# EAGLE design Mega Stepper Shield (EAGLE 9.6.2)
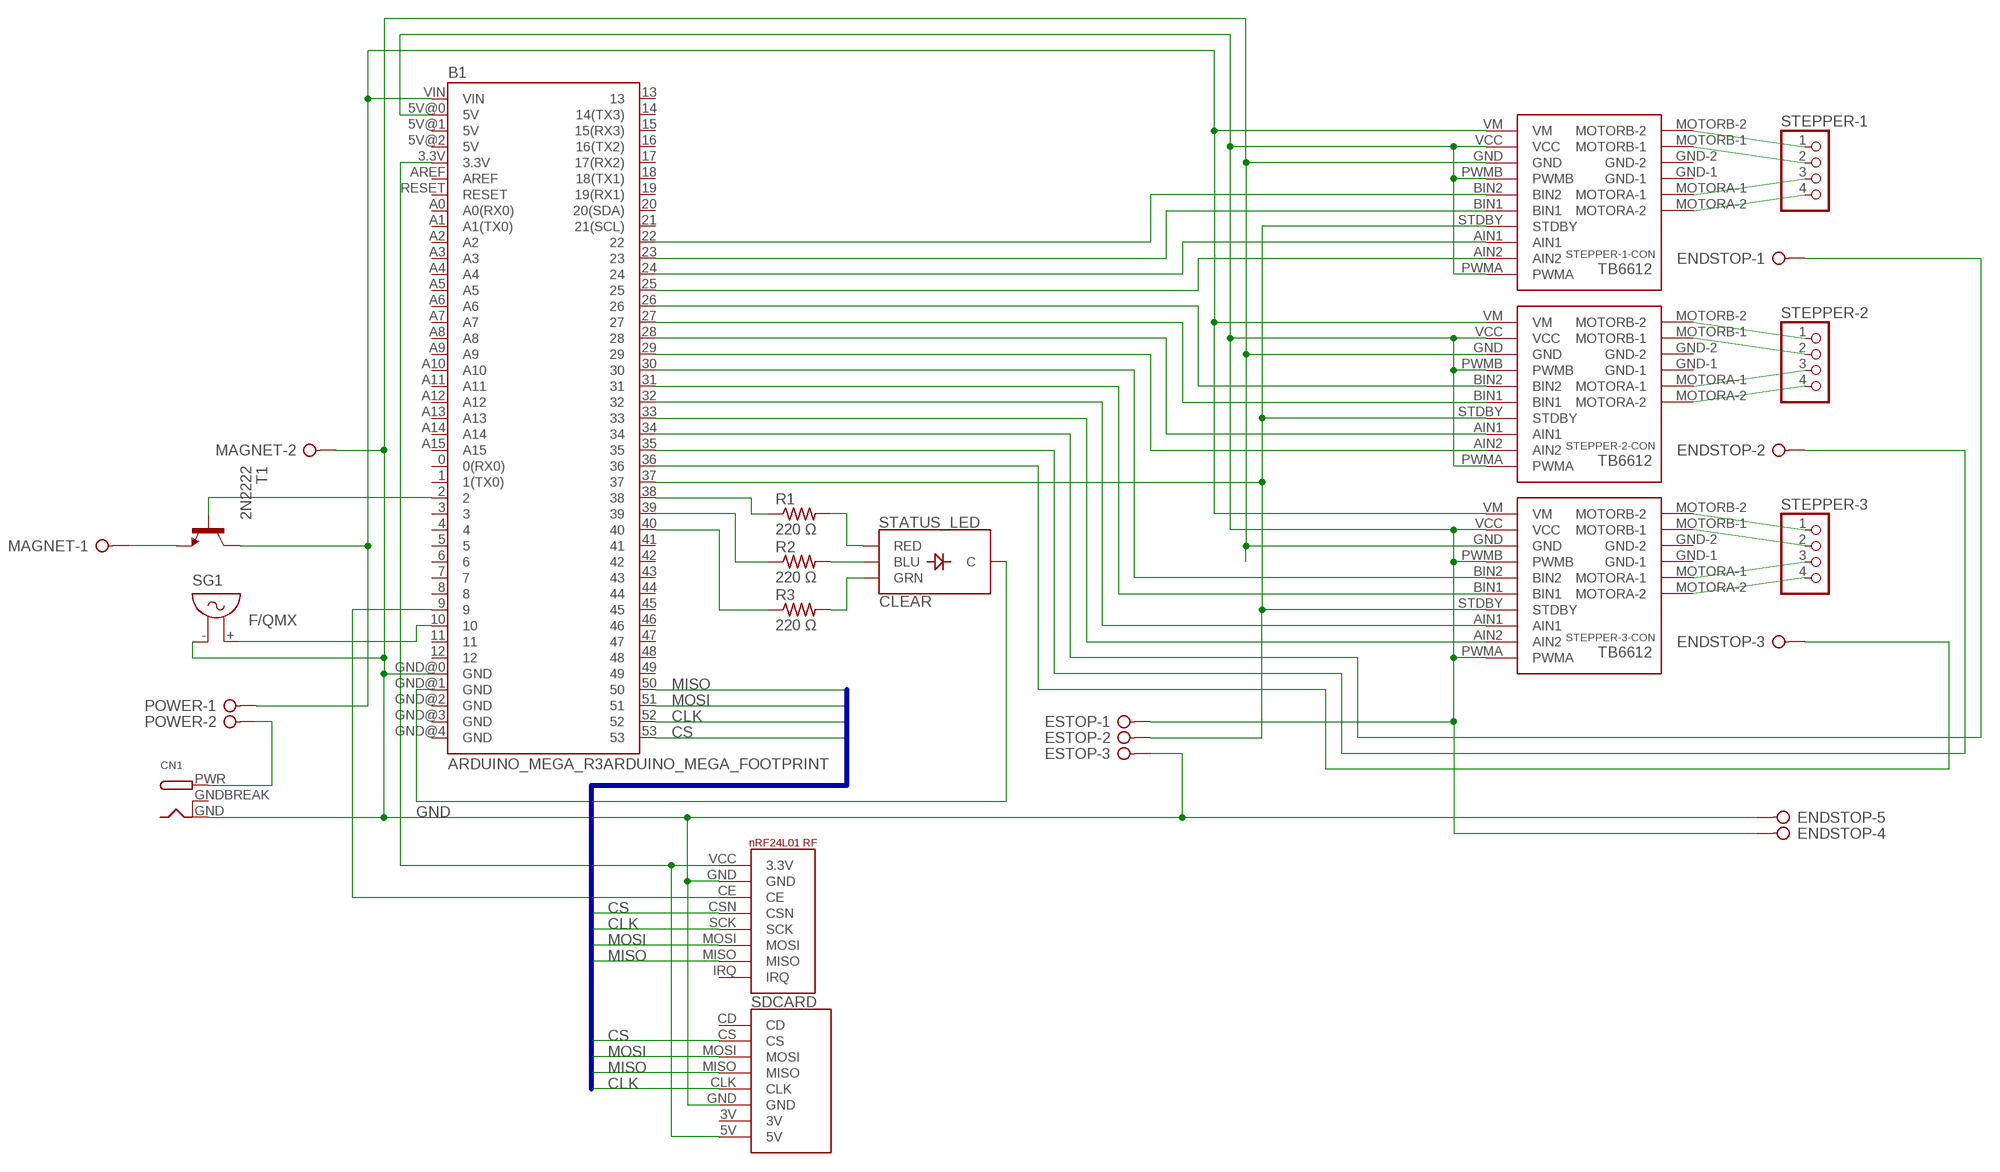
[diagram p0: schematic, sheet 1]

## Parts
B1  ARDUINO_MEGA_R3ARDUINO_MEGA_FOOTPRINT  [ARDUINO_MEGA_SHIELD_DIMENSIONLESS]
CN1  DCBARRELPTH  [DCJACK_2MM_PTH]
ENDSTOP  W237-05P  [W237-5P]
ESTOP  W237-3E  [W237-3E]
MAGNET  W237-02P  [W237-132]
POWER  W237-02P  [W237-132]
R1  220 Ω  R-US_0204/7  [0204/7]
R2  220 Ω  R-US_0204/7  [0204/7]
R3  220 Ω  R-US_0204/7  [0204/7]
SDCARD  MICRO_SD_BREAKOUT  [MICROSDCARDBREAKOUT]
SG1  F/QMX  [F/QMX]
STATUS_LED  CLEAR  LED-RGB-CCCLEAR  [LED-RGB-THRU]
STEPPER-1  PINHD-1X4  [1X04]
STEPPER-1-CON  TB6612-BREAKOUT-MOTOR-CONTROLLER  [TB6612-HEADERS]
STEPPER-2  PINHD-1X4  [1X04]
STEPPER-2-CON  TB6612-BREAKOUT-MOTOR-CONTROLLER  [TB6612-HEADERS]
STEPPER-3  PINHD-1X4  [1X04]
STEPPER-3-CON  TB6612-BREAKOUT-MOTOR-CONTROLLER  [TB6612-HEADERS]
T1  2N2222  [TO92-EBC-OVAL]
U$1  NRF24L01_RF_MODULE  [NRF24L01RF]

## Nets
3.3V [Power]: B1.3.3V SDCARD.5V U$1.VCC(3.3V)
5V: B1.5V@0(5V) ENDSTOP.4 ESTOP.1 STEPPER-1-CON.PWMA STEPPER-1-CON.PWMB STEPPER-1-CON.VCC STEPPER-2-CON.PWMA STEPPER-2-CON.PWMB STEPPER-2-CON.VCC STEPPER-3-CON.PWMA STEPPER-3-CON.PWMB STEPPER-3-CON.VCC
12V10A [Power]: B1.VIN POWER.1 STEPPER-1-CON.VM STEPPER-2-CON.VM STEPPER-3-CON.VM T1.C
AIN1: B1.24 STEPPER-1-CON.AIN1
AIN2: B1.25 STEPPER-1-CON.AIN2
BIN2: B1.22 STEPPER-1-CON.BIN2
CLK: B1.52 SDCARD.CLK U$1.SCK
CS: B1.53 SDCARD.CS U$1.CSN
GND [Power]: B1.GND@0(GND) CN1.GND ENDSTOP.5 ESTOP.3 MAGNET.2 SDCARD.GND SG1.- STEPPER-1-CON.GND STEPPER-2-CON.GND STEPPER-3-CON.GND U$1.GND
MISO: B1.50 SDCARD.MISO U$1.MISO
MOSI: B1.51 SDCARD.MOSI U$1.MOSI
N$1: B1.36 ENDSTOP.3
N$2: B1.10 SG1.+
N$3: B1.30 STEPPER-3-CON.BIN2
N$4: B1.26 STEPPER-2-CON.BIN2
N$5: B1.27 STEPPER-2-CON.BIN1
N$6: B1.28 STEPPER-2-CON.AIN1
N$7: B1.29 STEPPER-2-CON.AIN2
N$8: B1.31 STEPPER-3-CON.BIN1
N$9: B1.32 STEPPER-3-CON.AIN1
N$10: B1.33 STEPPER-3-CON.AIN2
N$11 [Power]: CN1.PWR POWER.2
N$12: B1.35 ENDSTOP.2
N$13: B1.37 ESTOP.2 STEPPER-1-CON.STDBY STEPPER-2-CON.STDBY STEPPER-3-CON.STDBY
N$14: B1.34 ENDSTOP.1
N$15 [Stepper Output]: STEPPER-1-CON.MOTORB-2 STEPPER-1.1
N$16 [Stepper Output]: STEPPER-1-CON.MOTORB-1 STEPPER-1.2
N$17 [Stepper Output]: STEPPER-1-CON.MOTORA-1 STEPPER-1.3
N$18 [Stepper Output]: STEPPER-1-CON.MOTORA-2 STEPPER-1.4
N$19 [Stepper Output]: STEPPER-2-CON.MOTORB-2 STEPPER-2.1
N$20 [Stepper Output]: STEPPER-2-CON.MOTORB-1 STEPPER-2.2
N$21 [Stepper Output]: STEPPER-2-CON.MOTORA-1 STEPPER-2.3
N$22 [Stepper Output]: STEPPER-2-CON.MOTORA-2 STEPPER-2.4
N$23 [Stepper Output]: STEPPER-3-CON.MOTORB-2 STEPPER-3.1
N$24 [Stepper Output]: STEPPER-3-CON.MOTORB-1 STEPPER-3.2
N$25 [Stepper Output]: STEPPER-3-CON.MOTORA-1 STEPPER-3.3
N$26 [Stepper Output]: STEPPER-3-CON.MOTORA-2 STEPPER-3.4
N$27: B1.23 STEPPER-1-CON.BIN1
N$28: R3.2 STATUS_LED.3(GRN)
N$29: R2.2 STATUS_LED.4(BLU)
N$30: R1.2 STATUS_LED.1(RED)
N$31: B1.GND@1(GND) STATUS_LED.2(C)
N$34: B1.9 U$1.CE
N$38: B1.38 R1.1
N$39: B1.39 R2.1
N$40: B1.40 R3.1
N$41: B1.2 T1.B
N$42 [Power]: MAGNET.1 T1.E
Unconnected: B1.0(0(RX0)) B1.1(1(TX0)) B1.3 B1.4 B1.5 B1.5V@1(5V) B1.5V@2(5V) B1.6 B1.7 B1.8 B1.11 B1.12 B1.13 B1.14(14(TX3)) B1.15(15(RX3)) B1.16(16(TX2)) B1.17(17(RX2)) B1.18(18(TX1)) B1.19(19(RX1)) B1.20(20(SDA)) B1.21(21(SCL)) B1.41 B1.42 B1.43 B1.44 B1.45 B1.46 B1.47 B1.48 B1.49 B1.A0(A0(RX0)) B1.A1(A1(TX0)) B1.A2 B1.A3 B1.A4 B1.A5 B1.A6 B1.A7 B1.A8 B1.A9 B1.A10 B1.A11 B1.A12 B1.A13 B1.A14 B1.A15 B1.AREF B1.GND@2(GND) B1.GND@3(GND) B1.GND@4(GND) B1.RESET SDCARD.3V SDCARD.CD STEPPER-1-CON.GND-1 STEPPER-1-CON.GND-2 STEPPER-2-CON.GND-1 STEPPER-2-CON.GND-2 STEPPER-3-CON.GND-1 STEPPER-3-CON.GND-2 U$1.IRQ

## Buses
SPI:CLK,CS,MISO,MOSI

## Power pins joined to a net without a drawn wire
GNDBREAK: CN1.GNDBREAK

## Library data of the parts
B1 = SparkFun-Boards-Expanded:ARDUINO_MEGA_R3: Arduino Mega R3 ATmega2560 R3 compatible footprint. SparkFun Products: Arduino Mega 2560 R3 <https://www.sparkfun.com/products/11061>
CN1 = adafruit:DCBARREL: 2.0mm DC Barrel Jack DCJACK_2MM_PTH - Through Hole Jack (4UConnector: 05537)
ENDSTOP = con-wago-508:W237-05P: WAGO SREW CLAMP; OC_FARNELL: unknown; OC_NEWARK: unknown
ESTOP = con-wago-508:W237-3E: WAGO SREW CLAMP; OC_FARNELL: unknown; OC_NEWARK: unknown
MAGNET POWER = con-wago-508:W237-02P: WAGO SREW CLAMP; OC_FARNELL: unknown; OC_NEWARK: unknown
R1-R3 = adafruit:R-US_: RESISTOR, American symbol
SDCARD = SparkFun-Boards-Expanded:MICRO_SD_BREAKOUT: Micro SD Card breakout board, product ID 254 https://www.adafruit.com/product/254
SG1 = buzzer:F/QMX: BUZZER Source: Buerklin; OC_FARNELL: unknown; OC_NEWARK: unknown
STATUS_LED = SparkFun-LED:LED-RGB-CC: LED-RGB Common Cathode Packages: LED RGB-THRU LED_PIRANHA_5MM SparkFun Products: RGB Diffused Common Cathode- Diffuse <[https://www.sparkfun.com/products/9264]> RGB Diffused Common Cathode - Clear <[https://www.sparkfun.com/products/105]> LED-RGB 5mm Square (Piranha) <[https://www.sparkfun.com/products/11679]>; PROD_ID: DIO-08418
STEPPER-1-STEPPER-3 = pinhead:PINHD-1X4: PIN HEADER
STEPPER-1-CON STEPPER-2-CON STEPPER-3-CON = SparkFun-Boards-Expanded:TB6612-BREAKOUT-MOTOR-CONTROLLER: TB6612 breakout headers
T1 = adafruit:2N2222: NPN TRANSISTOR Big oval pads
U$1 = SparkFun-Boards-Expanded:NRF24L01_RF_MODULE: Basic RF module

## Net classes
0 Signal: width 0.178 mm
1 Power: width 1.27 mm
2 Stepper Output: width 0.508 mm

## Board
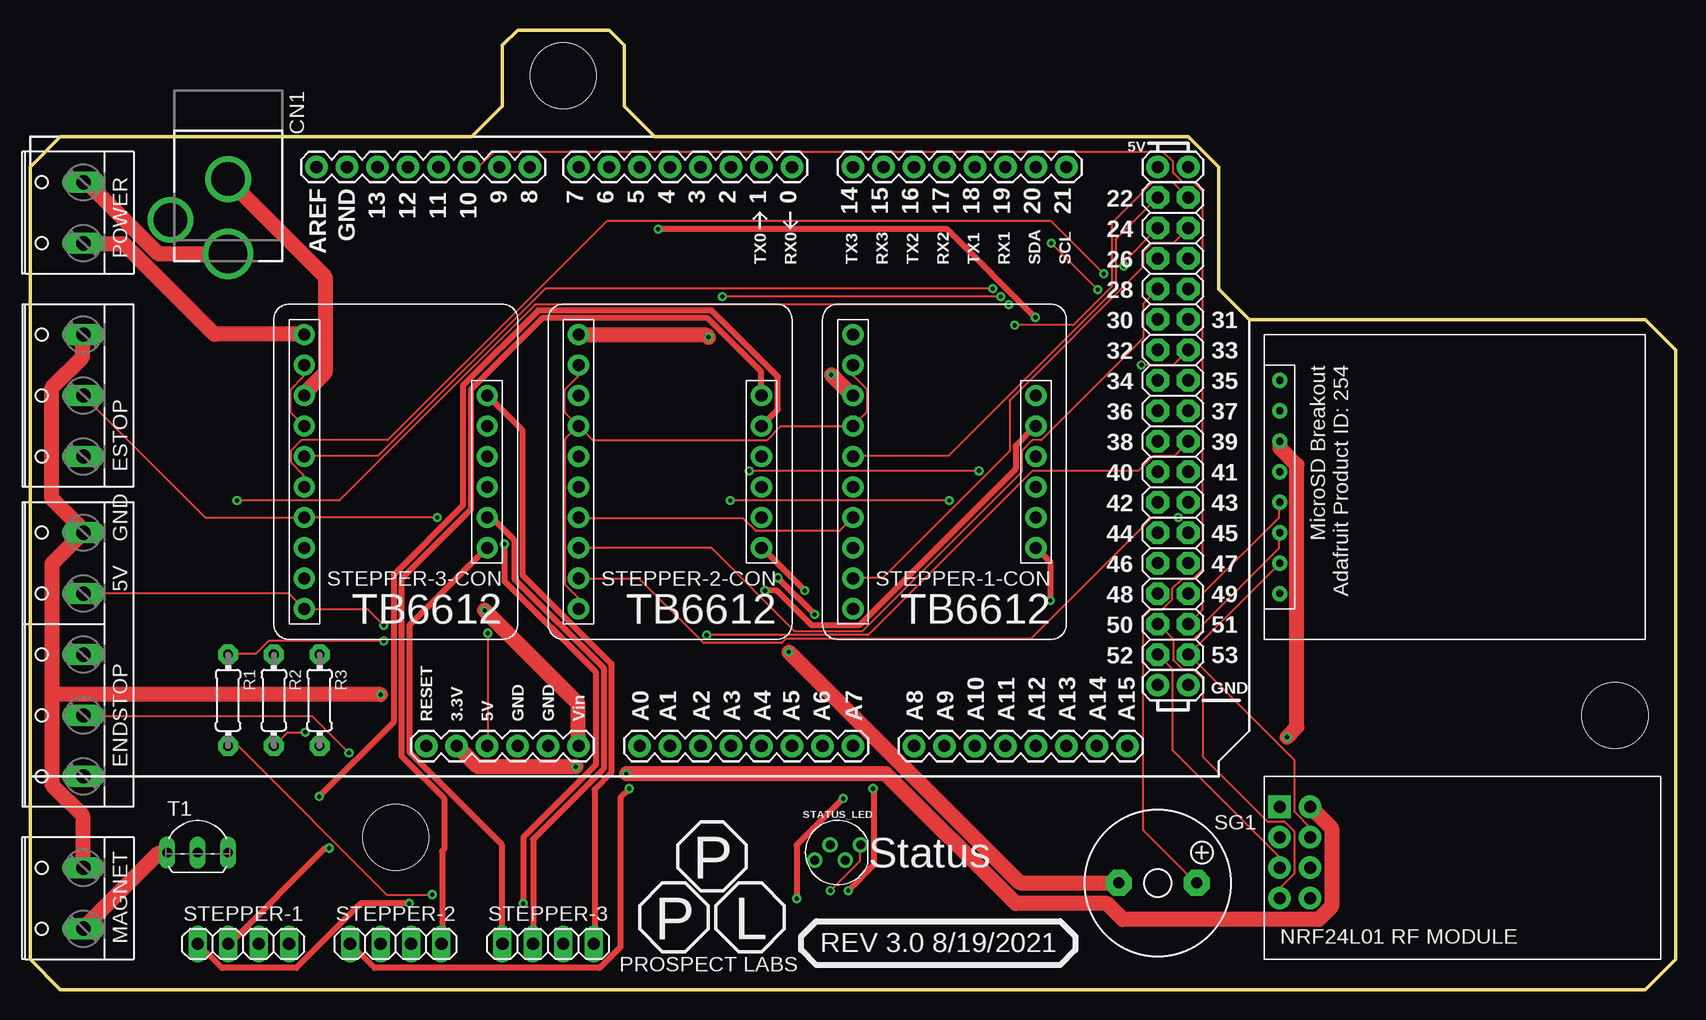
[diagram p1: board, top side]
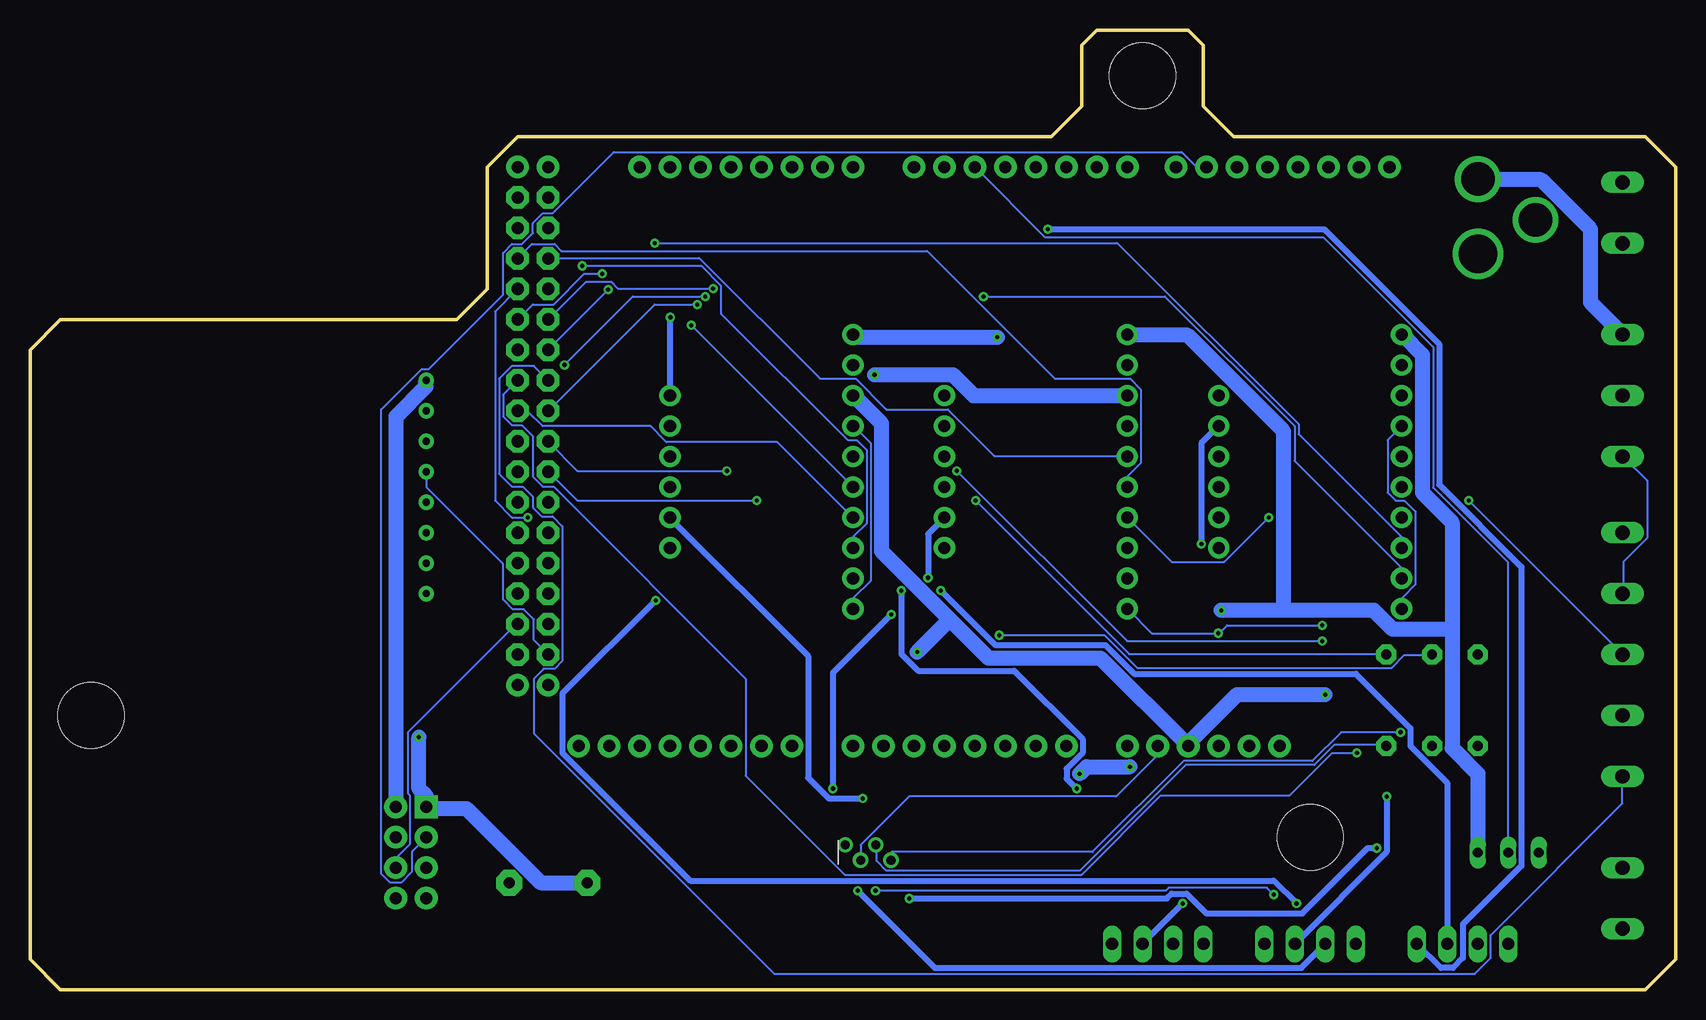
[diagram p2: board, bottom side, seen from below]

Size 137.16 x 80.01 mm. Coordinates in mm from the lower left corner, seen from the top.
Outline: 0,2.54 0,68.58 2.54,71.12 36.83,71.12 39.37,73.66 39.37,78.74 40.64,80.01 48.26,80.01 49.53,78.74 49.53,73.66 52.07,71.12 96.52,71.12 99.06,68.58 99.06,58.42 101.6,55.88 134.62,55.88 137.16,53.34 137.16,2.54 134.62,0 2.54,0 0,2.54
Copper layers (1*16): Top 0.035mm / dielectric 1.5mm / Bottom 0.035mm
Design rules "default": minimum track width 6mil, minimum drill 0.35mm, track to track 6mil, track to pad 6mil, pad to pad 6mil, via to via 6mil, smd to smd 6mil, copper to edge 40mil, drill to drill 6mil, minimum pad ring 10mil, minimum via ring 8mil, stop-mask expansion 4mil, vias tented up to drill 0mil, thermal gap 10mil
Holes 5.5 mm at 30.48,12.7 132.08,22.86 44.45,76.2
tRestrict: area 49.5,1.3 to 63.5,15.2; area 64.3,1.4 to 87.1,6.5
vRestrict: area 26.4,8.6 to 34.5,16.8; area 128,18.8 to 136.1,26.9; area 40.4,72.1 to 48.5,80.3

### Footprints (pad centres in the part's own frame; a part is rotated, then mirrored left to right if it is on the bottom)
ARDUINO_MEGA_SHIELD_DIMENSIONLESS = drill 1.016 pad 1.88: 0 13.97,24.13; 1 11.43,24.13; 2 8.89,24.13; 3 6.35,24.13; 3.3V -13.97,-24.13; 4 3.81,24.13; 5 1.27,24.13; 5V@0 -11.43,-24.13; 5V@1 44.45,24.13; 5V@2 46.99,24.13; 6 -1.27,24.13; 7 -3.81,24.13; 8 -7.874,24.13; 9 -10.414,24.13; 10 -12.954,24.13; 11 -15.494,24.13; 12 -18.034,24.13; 13 -20.574,24.13; 14 19.05,24.13; 15 21.59,24.13; 16 24.13,24.13; 17 26.67,24.13; 18 29.21,24.13; 19 31.75,24.13; 20 34.29,24.13; 21 36.83,24.13; A0 1.27,-24.13; A1 3.81,-24.13; A2 6.35,-24.13; A3 8.89,-24.13; A4 11.43,-24.13; A5 13.97,-24.13; A6 16.51,-24.13; A7 19.05,-24.13; A8 24.13,-24.13; A9 26.67,-24.13; A10 29.21,-24.13; A11 31.75,-24.13; A12 34.29,-24.13; A13 36.83,-24.13; A14 39.37,-24.13; A15 41.91,-24.13; AREF -25.654,24.13; GND@0 -8.89,-24.13; GND@1 -6.35,-24.13; GND@2 44.45,-19.05; GND@3 46.99,-19.05; GND@4 -23.114,24.13; RESET -16.51,-24.13; VIN -3.81,-24.13 | drill 1.016 pad 1.88 octagon: 22 44.45,21.59; 23 46.99,21.59; 24 44.45,19.05; 25 46.99,19.05; 26 44.45,16.51; 27 46.99,16.51; 28 44.45,13.97; 29 46.99,13.97; 30 44.45,11.43; 31 46.99,11.43; 32 44.45,8.89; 33 46.99,8.89; 34 44.45,6.35; 35 46.99,6.35; 36 44.45,3.81; 37 46.99,3.81; 38 44.45,1.27; 39 46.99,1.27; 40 44.45,-1.27; 41 46.99,-1.27; 42 44.45,-3.81; 43 46.99,-3.81; 44 44.45,-6.35; 45 46.99,-6.35; 46 44.45,-8.89; 47 46.99,-8.89; 48 44.45,-11.43; 49 46.99,-11.43; 50 44.45,-13.97; 51 46.99,-13.97; 52 44.45,-16.51; 53 46.99,-16.51
DCJACK_2MM_PTH = drill 2.8: GND 0,7.35; GNDBREAK 4.8,10.75 | drill 3.2: PWR 0,13.6
W237-5P = drill 1.194 long: 1 -10.16,-0.635; 2 -5.08,-0.635; 3 0,-0.635; 4 5.08,-0.635; 5 10.16,-0.635
W237-3E = drill 1.194 long: 1 -5.08,-0.635; 2 0,-0.635; 3 5.08,-0.635
W237-132 = drill 1.194 long: 1 -2.54,-0.635; 2 2.54,-0.635
0204/7 = drill 0.813 pad 1.676 octagon: 1 -3.81,0; 2 3.81,0
MICROSDCARDBREAKOUT = drill 0.6 pad 1.27: 3V 5.08,-6.35; 5V 5.08,-8.89; CD 5.08,8.89; CLK 5.08,-1.27; CS 5.08,6.35; GND 5.08,-3.81; MISO 5.08,3.81; MOSI 5.08,1.27
F/QMX = drill 0.914 pad 2.159 octagon: + 3.251,0; - -3.251,0
LED-RGB-THRU = drill 0.762 pad 1.016: 1 1.905,0.635; 2 0.635,-0.635; 3 -0.635,0.635; 4 -1.905,-0.635
1X04 = drill 1.016 long: 1 -3.81,0; 2 -1.27,0; 3 1.27,0; 4 3.81,0
TB6612-HEADERS = drill 1.016 pad 1.778: AIN1 -7.62,-6.35; AIN2 -7.62,-8.89; BIN1 -7.62,-1.27; BIN2 -7.62,1.27; GND -7.62,6.35; GND-1 7.62,-1.27; GND-2 7.62,1.27; MOTORA-1 7.62,-3.81; MOTORA-2 7.62,-6.35; MOTORB-1 7.62,3.81; MOTORB-2 7.62,6.35; PWMA -7.62,-11.43; PWMB -7.62,3.81; STDBY -7.62,-3.81; VCC -7.62,8.89; VM -7.62,11.43
TO92-EBC-OVAL = drill 0.813 long: B 0,-1.27; C 2.54,-1.27; E -2.54,-1.27
NRF24L01RF = drill 1.016 pad 1.88: CE 0,8.89; CSN 2.54,8.89; IRQ 2.54,3.81; MISO 0,3.81; MOSI 2.54,6.35; SCK 0,6.35; VCC 2.54,11.43 | drill 1.016 pad 1.88 square: GND 0,11.43

### Placement (x,y rotation side)
B1  49.53,44.45 0 top
CN1  16.51,74.93 180 top
ENDSTOP  3.81,27.94 90 top
ESTOP  3.81,49.53 90 top
MAGNET  3.81,7.62 90 top
POWER  3.81,64.77 90 top
R1  16.51,24.13 270 top
R2  20.32,24.13 270 top
R3  24.13,24.13 270 top
SDCARD  109.22,41.91 180 top
SG1  93.98,8.89 0 top
STATUS_LED  67.31,11.43 0 top
STEPPER-1  17.78,3.81 180 top
STEPPER-1-CON  76.2,43.18 0 top
STEPPER-2  30.48,3.81 180 top
STEPPER-2-CON  53.34,43.18 0 top
STEPPER-3  43.18,3.81 180 top
STEPPER-3-CON  30.48,43.18 0 top
T1  13.97,12.7 0 top
U$1  104.14,3.81 0 top

### Tracks (layer width: path | path; a pad name or v marks a point on that pad's centre or on a via)
3.3V  (via drill 0.35)
  Top 1.27: v45.48,18.57 37.31,18.57 35.58,20.31 B1.3.3V | v49.7,18 71.32,18 82.14,7.18 89.73,7.18 91.05,5.86 107.4,5.86 108.47,6.93 108.47,13.46 106.74,15.19 U$1.VCC
  Bottom 1.27: SDCARD.5V 104.18,50.77 104.18,50.27 106.66,47.8 106.66,15.27 U$1.VCC | v45.48,18.57 49.12,18.57 v49.7,18
5V  (via drill 0.35)
  Top 0.178: STEPPER-3-CON.VCC 22.78,52.01 22.78,51.1 21.71,50.02 21.71,48.13 22.78,47.05 STEPPER-3-CON.PWMB | ENDSTOP.4 21.55,33.02 22.78,31.78 STEPPER-3-CON.PWMA 22.87,31.7 28.15,31.7 v29.47,30.38 | STEPPER-1-CON.VCC 68.6,52.01 68.6,51.18 69.75,50.02 69.75,48.21 68.6,47.05 STEPPER-1-CON.PWMB 68.52,46.97 62.57,46.97 61.42,45.81 46.89,45.81 45.73,46.97 STEPPER-2-CON.PWMB | STEPPER-2-CON.PWMA 45.65,31.78 45.65,32.69 44.58,33.76 44.58,45.9 45.65,46.97 STEPPER-2-CON.PWMB | STEPPER-2-CON.VCC 45.65,52.01 45.65,51.1 44.58,50.02 44.58,48.13 45.65,47.05 STEPPER-2-CON.PWMB | v38.14,29.72 38.14,20.39 B1.5V@0
  Bottom 0.178: ENDSTOP.4 4.38,33.02 4.38,35.66 2.39,37.64 2.39,42.43 4.38,44.41 ESTOP.1 | STEPPER-3-CON.PWMA 22.78,31.78 22.78,32.69 21.71,33.76 21.71,39.87 22.62,40.78 23.36,40.78 24.02,41.44 24.02,45.81 22.87,46.97 STEPPER-3-CON.PWMB | STEPPER-1-CON.PWMA 68.52,31.78 68.52,32.69 67.11,34.09 67.11,45.57 68.52,46.97 STEPPER-1-CON.PWMB | STEPPER-2-CON.PWMA 45.65,31.7 43.67,29.72 v38.14,29.72 38.06,29.72 37.4,30.38 v29.47,30.38
12V10A  (via drill 0.35)
  Top 1.27: v56.55,54.4 56.38,54.57 45.73,54.57 STEPPER-2-CON.VM | POWER.1 4.46,62.16 7.84,62.16 15.35,54.65 22.78,54.65 STEPPER-3-CON.VM | v37.89,31.62 45.65,23.86 45.65,20.39 B1.VIN
  Bottom 1.27: v56.55,54.4 68.35,54.4 68.52,54.57 STEPPER-1-CON.VM | T1.C 16.51,18 18.66,20.14 18.66,30.05 | 18.66,30.05 18.66,38.96 21.13,41.44 21.13,52.91 22.78,54.57 STEPPER-3-CON.VM | 32.69,31.62 25.18,31.62 23.61,30.05 18.66,30.05 | 32.69,31.62 v37.89,31.62 | 32.69,31.62 32.69,46.56 40.7,54.57 45.65,54.57 STEPPER-2-CON.VM
AIN1  (via drill 0.35)
  Top 0.178: v91.14,60.34 91.14,60.67 93.94,63.48 B1.24
  Bottom 0.178: v91.14,60.34 81.23,60.34 79.58,58.69 79.58,56.38 69.01,45.81 68.27,45.81 67.44,44.99 67.44,38.88 68.52,37.81 68.52,36.9 STEPPER-1-CON.AIN1
AIN2
  Top 0.178: B1.25 95.26,62.24 93.53,62.24 92.79,61.5 92.79,60.26 81.64,49.12 81.64,44.91 71.08,34.34 68.6,34.34 STEPPER-1-CON.AIN2
BIN2
  Top 0.178: STEPPER-1-CON.BIN2 68.6,44.49 76.52,44.49 90.47,58.45 90.47,62.57 93.94,66.04 B1.22
CLK
  Top 0.178: U$1.SCK 104.1,10.24 104.1,11.06 95.18,19.98 95.18,26.75 94.02,27.9 B1.52
  Bottom 0.178: B1.52 95.18,29.14 95.18,30.87 96.01,31.7 96.91,31.7 97.74,32.52 97.74,35.5 104.1,41.85 104.1,43.17 SDCARD.CLK
CS
  Top 0.178: SDCARD.CS 104.1,35.5 96.58,27.98 B1.53 96.58,27.9 105.33,19.15 105.33,14.86 106.66,13.54 106.66,12.71 U$1.CSN
GND  (via drill 0.35)
  Top 1.27: STEPPER-3-CON.GND 22.87,49.7 24.6,51.43 24.6,59.44 16.51,67.53 CN1.GND | 1.82,24.6 1.82,35.5 4.38,38.06 ENDSTOP.5 4.13,38.63 1.82,40.95 1.82,50.19 4.38,52.75 4.38,54.57 ESTOP.3 | 1.82,24.6 1.82,17.09 4.38,14.53 4.38,10.24 MAGNET.2 | v104.76,21.05 105.58,21.88 105.58,43.75 104.18,45.16 104.18,45.65 SDCARD.GND | v66.78,51.26 68.52,49.53 STEPPER-1-CON.GND | v63.23,28.15 82.47,8.91 90.72,8.91 SG1.- | v29.22,24.6 1.82,24.6
  Bottom 1.27: CN1.GND 16.51,67.53 11.23,67.53 7.1,63.4 7.1,57.29 4.46,54.65 ESTOP.3 | v104.76,21.05 104.76,16.76 104.18,16.18 104.18,15.27 U$1.GND 103.52,15.11 100.79,15.11 94.6,8.91 90.81,8.91 SG1.- | STEPPER-2-CON.GND 58.53,49.53 60.26,51.26 v66.78,51.26 | 60.51,30.87 66.2,36.57 66.2,47.22 68.52,49.53 STEPPER-1-CON.GND | 60.51,30.87 57.29,27.65 47.96,27.65 40.7,20.39 B1.GND@0 40.28,20.89 36.57,24.6 v29.22,24.6 | 60.51,30.87 v63.23,28.15
MISO
  Top 0.178: 95.26,29.22 97,29.22 97.74,29.97 97.74,30.46 104.1,36.82 104.1,38.06 SDCARD.MISO | 95.26,29.22 94.02,30.46 B1.50 | 95.26,29.22 95.26,27.49 96.01,26.75 96.91,26.75 97.74,25.92 97.74,19.4 103.11,14.03 104.51,14.03 105.33,13.21 105.33,9.66 104.18,8.5 104.18,7.68 U$1.MISO
MOSI
  Top 0.178: B1.51 97.74,31.7 97.74,33.02 104.1,39.38 104.1,40.62 SDCARD.MOSI
  Bottom 0.178: U$1.MOSI 106.66,10.24 106.66,10.98 105.5,12.13 105.5,16.18 105.66,16.34 105.66,21.46 96.58,30.54 B1.51
N$1  (via drill 0.35)
  Top 0.178: v17.25,40.78 25.76,40.78 42.1,57.12 v81.56,57.12
  Bottom 0.178: v17.25,40.78 4.46,27.98 ENDSTOP.3 | v81.56,57.12 85.11,57.12 93.94,48.29 B1.36
N$2
  Top 0.178: B1.10 36.65,68.6 37.4,68.6 38.63,69.84 94.44,69.84 95.26,69.01 95.26,68.1 96.09,67.28 97,67.28 97.74,66.53 97.74,35.08 96.91,34.26 96.01,34.26 95.18,33.43 95.18,32.52 94.36,31.7 93.45,31.7 92.79,31.04 92.79,13.29 97.16,8.91 SG1.+
N$3  (via drill 0.35)
  Top 0.178: v80.24,58.45 42.93,58.45 28.98,44.49 22.87,44.49 STEPPER-3-CON.BIN2
  Bottom 0.178: v80.24,58.45 88.16,58.45 88.74,59.02 90.81,59.02 93.94,55.89 B1.30
N$4
  Bottom 0.178: STEPPER-2-CON.BIN2 45.73,44.49 56.79,44.49 60.67,48.37 65.79,48.37 68.35,50.93 71.32,50.93 81.39,61 93.94,61 B1.26
N$5
  Bottom 0.178: STEPPER-2-CON.BIN1 45.65,41.94 45.65,42.84 44.58,43.92 44.58,50.02 45.48,50.93 51.76,50.93 62.41,61.58 92.87,61.58 93.45,62.16 95.34,62.16 96.5,61 B1.27
N$6
  Top 0.178: STEPPER-2-CON.AIN1 45.73,36.82 56.79,36.82 63.73,29.88 69.34,29.88 82.63,43.17 82.63,44.91 83.54,45.81 84.28,45.81 92.79,54.32 92.79,57.21 93.94,58.36 B1.28
N$7  (via drill 0.35)
  Top 0.178: v95.67,39.38 93.53,39.38 83.38,29.22 62.99,29.22 62.66,28.89 56.13,28.89 50.77,34.26 45.73,34.26 STEPPER-2-CON.AIN2
  Bottom 0.178: v95.67,39.38 97,39.38 98.4,40.78 98.4,56.55 96.58,58.36 B1.29
N$8  (via drill 0.35)
  Top 0.178: v89.48,59.68 85.11,64.06 48.04,64.06 29.8,45.81 22.62,45.81 21.71,44.91 21.71,44 22.78,42.93 22.78,41.94 STEPPER-3-CON.BIN1
  Bottom 0.178: v89.48,59.68 90.97,59.68 93.53,57.12 95.26,57.12 96.5,55.89 B1.31
N$9  (via drill 0.35)
  Top 0.178: v88.99,58.36 v85.11,62.24
  Bottom 0.178: v85.11,62.24 46.56,62.24 31.45,47.14 31.45,46.31 22.87,37.73 22.87,36.9 STEPPER-3-CON.AIN1 | v88.99,58.36 93.94,53.41 B1.32
N$10  (via drill 0.35)
  Top 0.178: v80.9,57.78 v57.7,57.78 | v92.62,52.09 95.26,52.09 96.5,53.33 B1.33
  Bottom 0.178: v57.7,57.78 42.6,57.78 31.78,46.97 31.78,44.08 22.87,35.17 22.87,34.34 STEPPER-3-CON.AIN2 | v80.9,57.78 86.92,57.78 v92.62,52.09
N$11
  Top 1.27: POWER.2 4.46,67.28 4.79,67.28 10.73,61.34 CN1.PWR
N$12  (via drill 0.35)
  Top 0.178: v26.58,19.73 23.53,22.78 4.46,22.78 ENDSTOP.2
  Bottom 0.178: v26.58,19.73 28.64,19.73 32.19,16.18 42.93,16.18 49.53,9.58 69.26,9.58 77.51,17.83 77.51,25.92 93.53,41.94 94.44,41.94 95.26,42.76 95.26,46.15 96.17,47.05 97,47.05 97.74,47.8 97.74,49.61 96.58,50.77 B1.35
N$13  (via drill 0.35)
  Top 0.178: ESTOP.2 14.61,39.38 22.78,39.38 STEPPER-3-CON.STDBY 22.95,39.38 v33.93,39.38 | STEPPER-2-CON.STDBY 45.73,39.29 59.44,39.29 60.51,38.22 67.44,38.22 68.52,39.29 STEPPER-1-CON.STDBY
  Bottom 0.178: B1.37 96.5,48.21 95.67,48.21 94.44,46.97 85.44,46.97 84.12,45.65 74.87,45.65 68.6,39.38 STEPPER-1-CON.STDBY | v33.93,39.38 37.64,35.66 42.02,35.66 45.65,39.29 STEPPER-2-CON.STDBY
N$14
  Bottom 0.178: ENDSTOP.1 4.46,17.75 4.46,15.52 15.44,4.54 15.44,2.64 16.76,1.32 75.12,1.32 95.18,21.38 95.18,25.92 94.36,26.75 93.45,26.75 92.79,27.41 92.79,38.63 93.61,39.46 94.52,39.46 95.26,40.2 95.26,41.11 96.09,41.94 97,41.94 98.07,43.01 98.07,50.93 97,52.01 95.18,52.01 94.02,50.85 B1.34
N$15  (via drill 0.35)
  Top 0.508: v52.34,63.4 76.44,63.4 v83.79,56.05
  Bottom 0.508: v52.34,63.4 29.3,63.4 19.73,53.82 19.73,42.1 12.88,35.25 12.88,10.32 17.75,5.45 17.75,2.64 18.57,1.82 19.56,1.82 21.55,3.8 STEPPER-1.1 | v83.79,56.05 83.79,49.53 STEPPER-1-CON.MOTORB-2
N$16  (via drill 0.35)
  Top 0.508: v61.25,33.27 62.24,33.27 65.13,30.38 69.09,30.38 82.14,43.42 82.14,45.32 83.79,46.97 STEPPER-1-CON.MOTORB-1
  Bottom 0.508: v61.25,33.27 56.71,28.73 47.55,28.73 45.16,26.33 26.66,26.33 22.12,21.79 22.12,20.31 19.07,17.25 19.07,3.88 STEPPER-1.2
N$17  (via drill 0.35)
  Top 0.508: v24.93,11.8 24.6,11.8 16.68,3.88 16.51,3.88 STEPPER-1.3 | v63.89,7.59 63.89,12.05 v67.77,15.93
  Bottom 0.508: v24.93,11.8 25.67,11.8 31.12,6.36 39.13,6.36 40.78,8.01 42.02,8.01 42.43,7.59 v63.89,7.59 | v67.77,15.93 70.58,15.93 72.31,17.67 72.31,27.82 83.79,39.29 STEPPER-1-CON.MOTORA-1
N$18  (via drill 0.35)
  Top 0.508: v31.62,7.18 27.57,7.18 22.21,1.82 16.02,1.82 14.03,3.8 STEPPER-1.4 | v85.03,32.44 85.03,35.66 83.87,36.82 STEPPER-1-CON.MOTORA-2
  Bottom 0.508: v31.62,7.18 33.52,9.08 82.14,9.08 92.79,19.73 92.79,24.68 v85.03,32.44
N$19
  Top 0.508: STEPPER-2.1 34.34,3.88 34.34,11.56 34.51,11.72 34.51,15.93 30.96,19.48 30.96,34.26 36.73,40.04 36.73,50.02 42.68,55.97 56.46,55.97 60.92,51.51 60.92,49.53 STEPPER-2-CON.MOTORB-2
N$20  (via drill 0.35)
  Top 0.508: v24.11,16.1 30.3,22.29 30.3,34.59 36.07,40.37 36.07,50.35 42.35,56.63 56.79,56.63 62.33,51.1 62.33,48.37 61,47.05 STEPPER-2-CON.MOTORB-1
  Bottom 0.508: v24.11,16.1 24.11,11.47 31.7,3.88 STEPPER-2.2
N$21  (via drill 0.35)
  Top 0.508: v68.19,8.26 70.33,10.4 70.33,16.68 v70.25,16.76 | v62.33,34.34 v65.38,31.29
  Bottom 0.508: STEPPER-2.3 31.2,1.82 61.75,1.82 v68.19,8.26 | v70.25,16.76 70.25,26.42 v65.38,31.29 | v62.33,34.34 62.33,37.97 61,39.29 STEPPER-2-CON.MOTORA-1
N$22  (via drill 0.35)
  Top 0.508: v49.94,16.76 49.2,16.02 49.2,3.55 47.47,1.82 28.73,1.82 26.75,3.8 STEPPER-2.4 | v64.55,33.27 61,36.82 STEPPER-2-CON.MOTORA-2
  Bottom 0.508: v49.94,16.76 50.77,17.58 50.77,18.41 49.45,19.73 49.45,20.89 55.14,26.58 63.15,26.58 64.55,27.98 v64.55,33.27
N$23
  Top 0.508: STEPPER-3.1 47.05,3.88 47.05,16.68 48.46,18.08 48.46,27.16 41.03,34.59 41.03,46.64 38.14,49.53 STEPPER-3-CON.MOTORB-2
N$24  (via drill 0.35)
  Top 0.508: v41.11,7.18 41.11,12.71 47.14,18.74 47.14,26.5 39.54,34.09 v39.54,37.15
  Bottom 0.508: v41.11,7.18 44.41,3.88 STEPPER-3.2 | v39.54,37.15 39.54,45.57 38.14,46.97 STEPPER-3-CON.MOTORB-1
N$25
  Top 0.508: STEPPER-3.3 41.94,3.88 41.94,12.55 47.8,18.41 47.8,26.83 40.37,34.26 40.37,37.48 38.55,39.29 38.14,39.29 STEPPER-3-CON.MOTORA-1
N$26
  Top 0.508: STEPPER-3.4 39.29,3.88 39.29,12.13 31.62,19.81 31.62,30.38 38.06,36.82 STEPPER-3-CON.MOTORA-2
N$27  (via drill 0.35)
  Top 0.178: v82.06,55.39 86.92,55.39 90.14,58.61 90.14,63.89 93.53,67.28 95.26,67.28 96.5,66.04 B1.23
  Bottom 0.178: v82.06,55.39 68.6,41.94 STEPPER-1-CON.BIN1
N$28
  Bottom 0.178: STATUS_LED.3 66.62,11.39 66.62,10.73 65.79,9.91 49.7,9.91 40.86,18.74 30.13,18.74 28.48,20.39 24.19,20.39 R3.2
N$29  (via drill 0.35)
  Top 0.178: v22.95,21.46 21.46,21.46 R2.2
  Bottom 0.178: v22.95,21.46 27.9,21.46 30.3,19.07 41.03,19.07 48.62,11.47 65.38,11.47 STATUS_LED.4
N$30  (via drill 0.35)
  Top 0.178: v66.7,8.26 69.18,10.73 69.18,11.39 STATUS_LED.1 | v33.52,7.92 29.72,7.92 17.34,20.31 16.51,20.31 R1.2
  Bottom 0.178: v66.7,8.26 42.51,8.26 42.27,8.5 34.09,8.5 v33.52,7.92
N$31
  Bottom 0.178: STATUS_LED.2 67.94,11.47 67.94,12.05 63.89,16.1 46.64,16.1 43.26,19.48 43.26,20.31 B1.GND@1
N$34
  Bottom 0.178: B1.9 39.13,68.6 39.95,68.6 41.19,69.84 88.49,69.84 93.61,64.72 94.44,64.72 95.26,63.89 95.26,63.07 96.17,62.16 97,62.16 97.74,61.42 97.74,57.95 103.93,51.76 104.51,51.76 107.89,48.37 107.89,9.66 107.15,8.91 106.24,8.91 105.33,9.82 105.33,11.47 104.18,12.63 U$1.CE
N$38  (via drill 0.35)
  Top 0.178: v29.47,29.06 19.89,29.06 18.82,27.98 16.51,27.98 R1.1 | v79.08,43.26 v59.93,43.26
  Bottom 0.178: v29.47,29.06 45.73,29.06 v59.93,43.26 | v79.08,43.26 91.55,43.26 93.94,45.65 B1.38
N$39  (via drill 0.35)
  Top 0.178: v56.38,29.55 69.84,29.55 83.54,43.26 92.37,43.26 93.61,44.49 95.34,44.49 96.5,45.65 B1.39
  Bottom 0.178: v56.38,29.55 47.63,29.55 44.91,26.83 23.69,26.83 22.62,27.9 20.39,27.9 R2.1
N$40  (via drill 0.35)
  Top 0.178: v76.61,40.78 v58.36,40.78
  Bottom 0.178: v58.36,40.78 45.57,27.98 24.19,27.98 R3.1 | v76.61,40.78 91.55,40.78 93.94,43.17 B1.40
N$41
  Bottom 0.178: T1.B 14.03,11.47 14.03,35.66 20.23,41.85 20.23,53.58 29.39,62.74 52.58,62.74 58.36,68.52 B1.2
N$42
  Top 1.27: T1.E 11.39,11.39 10.73,11.39 4.46,5.12 MAGNET.1

### Text on the board
tNames: GND | 5V | P | Status | P | L | REV 3.0 8/19/2021 | PROSPECT LABS